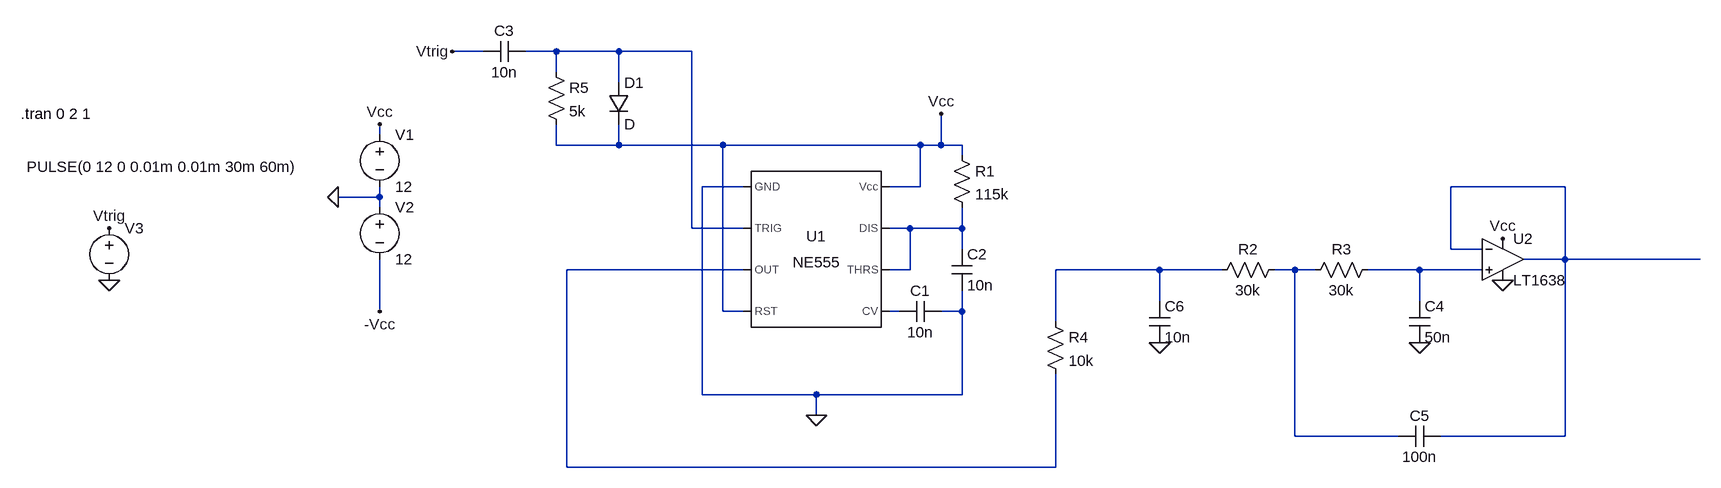
[diagram p0: schematic Differentiator__Monostable_Vibrator__Sallen_Key.asc]
Differentiator__Monostable_Vibrator__Sallen_Key.asc, the LTspice schematic file:
Version 4
SHEET 1 1812 680
WIRE -64 -112 -112 -112
WIRE 48 -112 0 -112
WIRE 144 -112 48 -112
WIRE 256 -112 144 -112
WIRE 48 -80 48 -112
WIRE 144 -64 144 -112
WIRE -224 16 -224 0
WIRE 48 32 48 0
WIRE 144 32 144 0
WIRE 144 32 48 32
WIRE 304 32 144 32
WIRE 608 32 304 32
WIRE 640 32 640 -16
WIRE 640 32 608 32
WIRE 672 32 640 32
WIRE 672 48 672 32
WIRE 336 96 272 96
WIRE 608 96 608 32
WIRE 608 96 560 96
WIRE 1600 96 1424 96
WIRE -224 112 -224 96
WIRE -224 112 -288 112
WIRE -224 128 -224 112
WIRE 256 160 256 -112
WIRE 336 160 256 160
WIRE 592 160 560 160
WIRE 672 160 672 128
WIRE 672 160 592 160
WIRE 672 192 672 160
WIRE 1424 192 1424 96
WIRE 1472 192 1424 192
WIRE 1600 208 1600 96
WIRE 1600 208 1536 208
WIRE 1808 208 1600 208
WIRE 336 224 64 224
WIRE 592 224 592 160
WIRE 592 224 560 224
WIRE 976 224 816 224
WIRE 1072 224 976 224
WIRE 1184 224 1152 224
WIRE 1216 224 1184 224
WIRE 1376 224 1296 224
WIRE 1472 224 1376 224
WIRE 976 272 976 224
WIRE 1376 272 1376 224
WIRE -224 288 -224 208
WIRE 304 288 304 32
WIRE 336 288 304 288
WIRE 576 288 560 288
WIRE 672 288 672 256
WIRE 672 288 640 288
WIRE 816 304 816 224
WIRE 272 416 272 96
WIRE 448 416 272 416
WIRE 672 416 672 288
WIRE 672 416 448 416
WIRE 448 448 448 416
WIRE 1184 480 1184 224
WIRE 1344 480 1184 480
WIRE 1600 480 1600 208
WIRE 1600 480 1408 480
WIRE 64 528 64 224
WIRE 816 528 816 384
WIRE 816 528 64 528
FLAG -288 112 0
FLAG -640 240 0
FLAG -224 0 Vcc
FLAG 640 -16 Vcc
FLAG -640 160 Vtrig
FLAG -112 -112 Vtrig
FLAG -224 288 -Vcc
FLAG 448 448 0
FLAG 1376 336 0
FLAG 1504 240 0
FLAG 1504 176 Vcc
FLAG 976 336 0
SYMBOL voltage -224 0 R0
WINDOW 123 0 0 Left 0
WINDOW 39 0 0 Left 0
SYMATTR InstName V1
SYMATTR Value 12
SYMBOL voltage -224 112 R0
WINDOW 123 0 0 Left 0
WINDOW 39 0 0 Left 0
SYMATTR InstName V2
SYMATTR Value 12
SYMBOL voltage -640 144 R0
WINDOW 3 -127 -79 Left 2
SYMATTR Value PULSE(0 12 0 0.01m 0.01m 30m 60m)
SYMATTR InstName V3
SYMBOL Misc\\NE555 448 192 R0
SYMATTR InstName U1
SYMBOL cap 640 272 R90
WINDOW 0 0 32 VBottom 2
WINDOW 3 32 32 VTop 2
SYMATTR InstName C1
SYMATTR Value 10n
SYMBOL cap 656 192 R0
SYMATTR InstName C2
SYMATTR Value 10n
SYMBOL res 656 32 R0
SYMATTR InstName R1
SYMATTR Value 115k
SYMBOL res 32 -96 R0
SYMATTR InstName R5
SYMATTR Value 5k
SYMBOL cap 0 -128 R90
WINDOW 0 0 32 VBottom 2
WINDOW 3 32 32 VTop 2
SYMATTR InstName C3
SYMATTR Value 10n
SYMBOL diode 128 -64 R0
SYMATTR InstName D1
SYMBOL res 1168 208 R90
WINDOW 0 0 56 VBottom 2
WINDOW 3 32 56 VTop 2
SYMATTR InstName R2
SYMATTR Value 30k
SYMBOL res 1312 208 R90
WINDOW 0 0 56 VBottom 2
WINDOW 3 32 56 VTop 2
SYMATTR InstName R3
SYMATTR Value 30k
SYMBOL cap 1360 272 R0
SYMATTR InstName C4
SYMATTR Value 50n
SYMBOL cap 1408 464 R90
WINDOW 0 0 32 VBottom 2
WINDOW 3 32 32 VTop 2
SYMATTR InstName C5
SYMATTR Value 100n
SYMBOL OpAmps\\LT1638 1504 144 R0
SYMATTR InstName U2
SYMBOL res 800 288 R0
SYMATTR InstName R4
SYMATTR Value 10k
SYMBOL cap 960 272 R0
SYMATTR InstName C6
SYMATTR Value 10n
TEXT -776 -16 Left 2 !.tran 0 2 1

The netlist it stands for:
* Differentiator__Monostable_Vibrator__Sallen_Key.asc
V1 Vcc 0 12
V2 0 -Vcc 12
V3 Vtrig 0 PULSE(0 12 0 0.01m 0.01m 30m 60m)
XU1 0 N001 N004 Vcc N008 N003 N003 Vcc NE555  ; pins GND TRIG OUT RST CV THRS DIS Vcc
C1 0 N008 10n
C2 N003 0 10n
R1 Vcc N003 115k
R5 N001 Vcc 5k
C3 N001 Vtrig 10n
D1 N001 Vcc D
R2 N006 N005 30k
R3 N007 N006 30k
C4 N007 0 50n
C5 N002 N006 100n
XU2 N007 N002 Vcc 0 N002 LT1638  ; pins In+ In- V+ V- OUT
R4 N005 N004 10k
C6 N005 0 10n
.model D D
.lib standard.dio
.tran 0 2 1
.lib NE555.sub
.backanno
.end